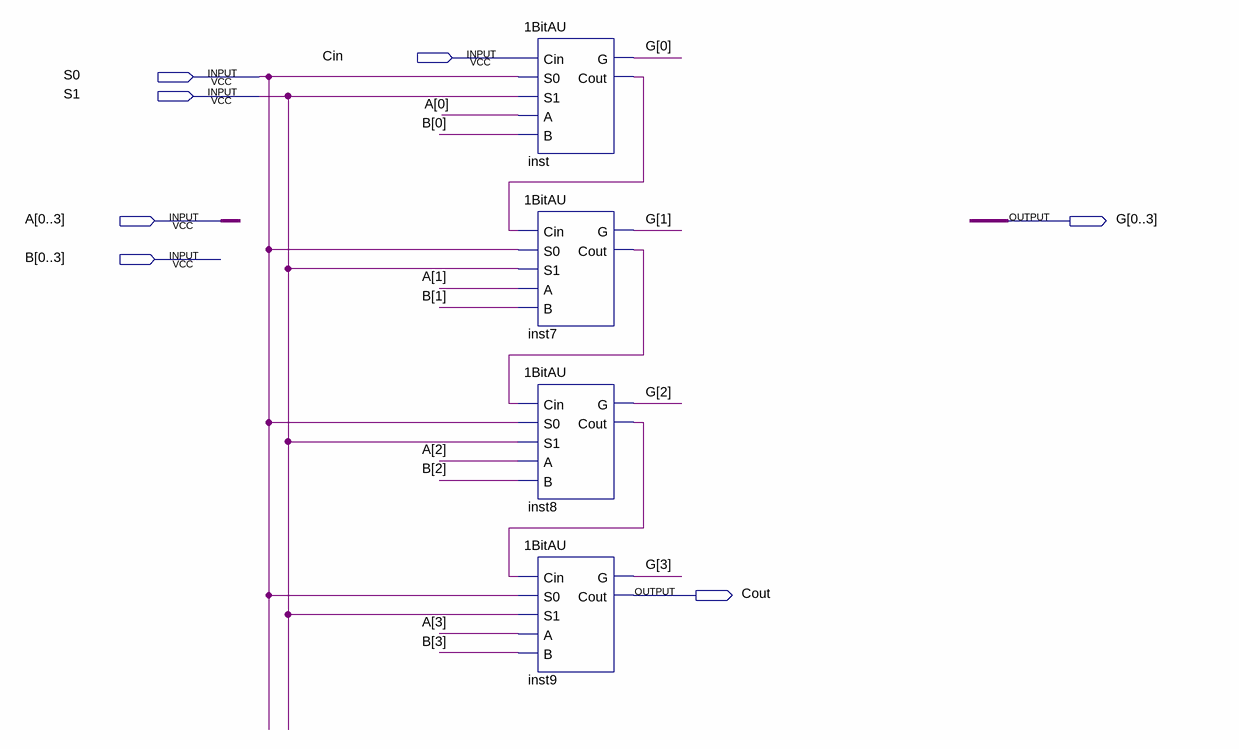
[diagram p0: schematic sheet]
// Quartus schematic 4BitAU.bdf as structural Verilog: 4 symbols, 7 pins
module \4BitAU  (
  input  Cin,
  input  S0,
  input  S1,
  input  [0:3] A,
  input  [0:3] B,
  output [0:3] G,
  output Cout
);

  wire inst7_cout, inst8_cout, inst_cout;

  \1BitAU  inst (.Cin(Cin), .S0(S0), .S1(S1), .A(A[0]), .B(B[0]), .G(G[0]), .Cout(inst_cout));
  \1BitAU  inst7 (.Cin(inst_cout), .S0(S0), .S1(S1), .A(A[1]), .B(B[1]), .G(G[1]), .Cout(inst7_cout));
  \1BitAU  inst8 (.Cin(inst7_cout), .S0(S0), .S1(S1), .A(A[2]), .B(B[2]), .G(G[2]), .Cout(inst8_cout));
  \1BitAU  inst9 (.Cin(inst8_cout), .S0(S0), .S1(S1), .A(A[3]), .B(B[3]), .G(G[3]), .Cout(Cout));
endmodule
